# Altium schematic sheet 16_TEC.SchDoc
size 420 x 297 mm; SheetNumber: 25; SheetTotal: 33
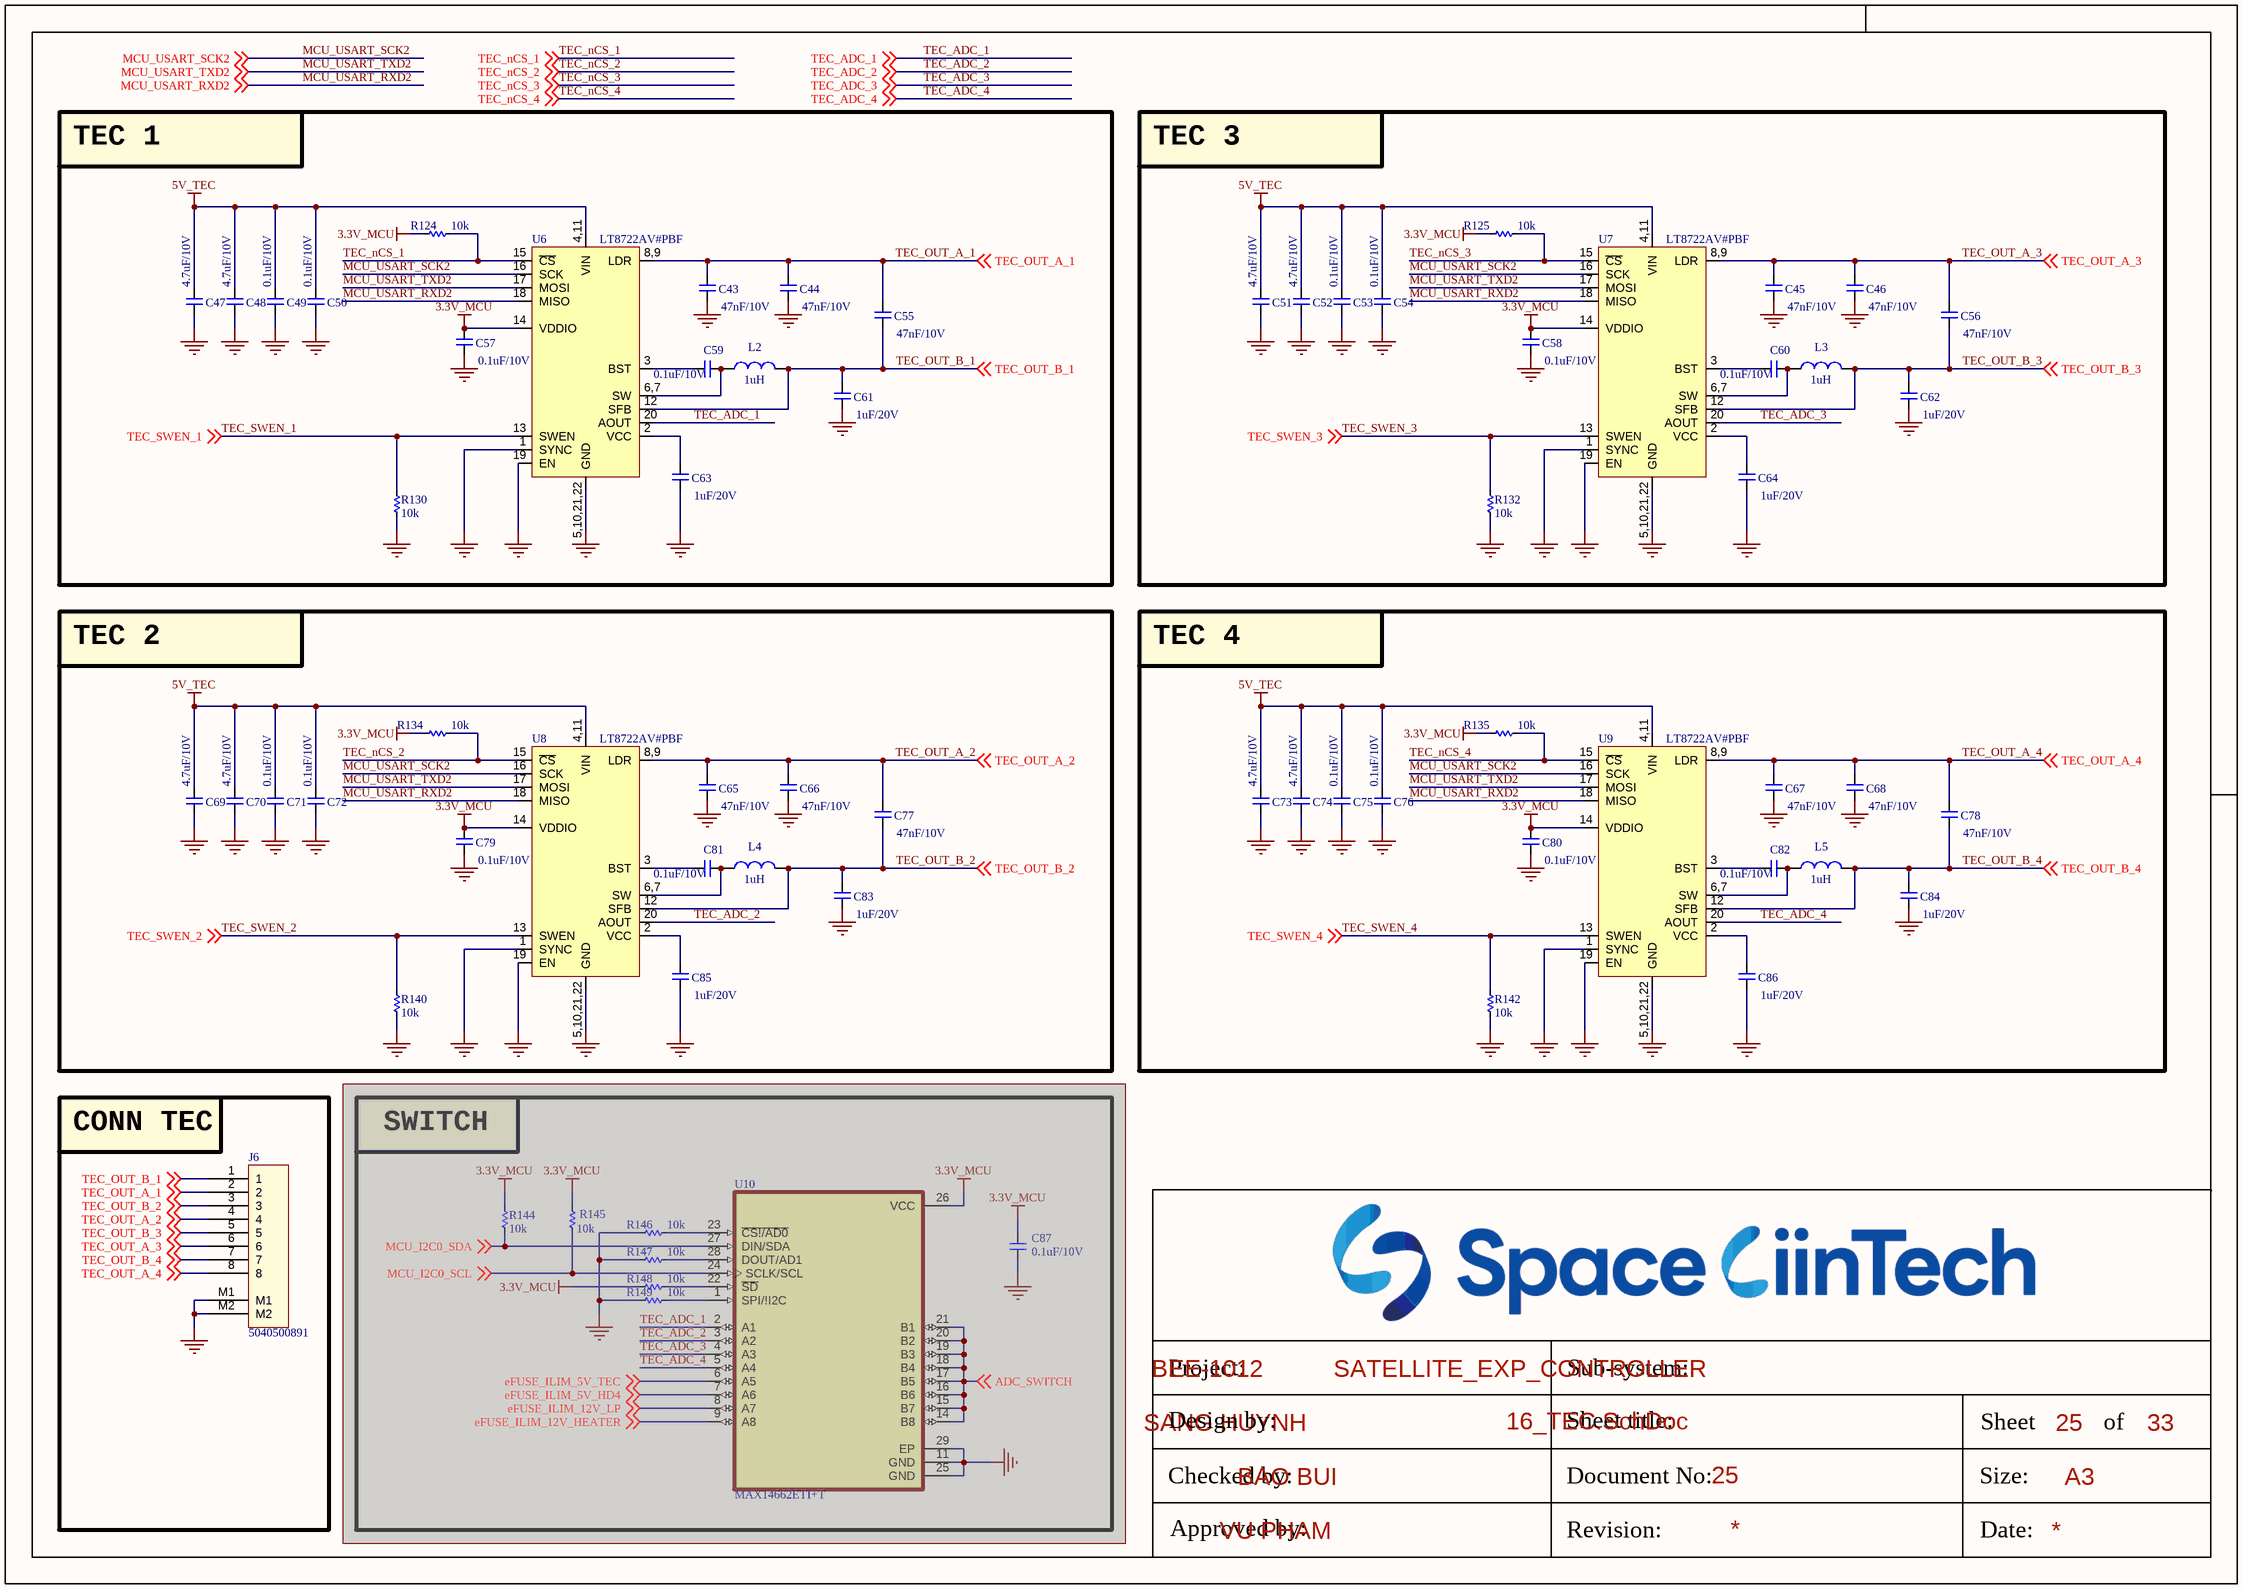
[diagram p0: 16_TEC.SchDoc]

## Parts
C43  47nF/10V  [CAP_C_1005X50_L]
C44  47nF/10V  [CAP_C_1005X50_L]
C45  47nF/10V  [CAP_C_1005X50_L]
C46  47nF/10V  [CAP_C_1005X50_L]
C47  4.7uF/10V  [CAP_C_1005X50_L]
C48  4.7uF/10V  [CAP_C_1005X50_L]
C49  0.1uF/10V  [CAP_C_1005X50_L]
C50  0.1uF/10V  [CAP_C_1005X50_L]
C51  4.7uF/10V  [CAP_C_1005X50_L]
C52  4.7uF/10V  [CAP_C_1005X50_L]
C53  0.1uF/10V  [CAP_C_1005X50_L]
C54  0.1uF/10V  [CAP_C_1005X50_L]
C55  47nF/10V  [CAP_C_1005X50_L]
C56  47nF/10V  [CAP_C_1005X50_L]
C57  0.1uF/10V  [CAP_C_1005X50_L]
C58  0.1uF/10V  [CAP_C_1005X50_L]
C59  0.1uF/10V  [CAP_C_1005X50_L]
C60  0.1uF/10V  [CAP_C_1005X50_L]
C61  1uF/20V  [CAP_C_1005X50_L]
C62  1uF/20V  [CAP_C_1005X50_L]
C63  1uF/20V  [CAP_C_1005X50_L]
C64  1uF/20V  [CAP_C_1005X50_L]
C65  47nF/10V  [CAP_C_1005X50_L]
C66  47nF/10V  [CAP_C_1005X50_L]
C67  47nF/10V  [CAP_C_1005X50_L]
C68  47nF/10V  [CAP_C_1005X50_L]
C69  4.7uF/10V  [CAP_C_1005X50_L]
C70  4.7uF/10V  [CAP_C_1005X50_L]
C71  0.1uF/10V  [CAP_C_1005X50_L]
C72  0.1uF/10V  [CAP_C_1005X50_L]
C73  4.7uF/10V  [CAP_C_1005X50_L]
C74  4.7uF/10V  [CAP_C_1005X50_L]
C75  0.1uF/10V  [CAP_C_1005X50_L]
C76  0.1uF/10V  [CAP_C_1005X50_L]
C77  47nF/10V  [CAP_C_1005X50_L]
C78  47nF/10V  [CAP_C_1005X50_L]
C79  0.1uF/10V  [CAP_C_1005X50_L]
C80  0.1uF/10V  [CAP_C_1005X50_L]
C81  0.1uF/10V  [CAP_C_1005X50_L]
C82  0.1uF/10V  [CAP_C_1005X50_L]
C83  1uF/20V  [CAP_C_1005X50_L]
C84  1uF/20V  [CAP_C_1005X50_L]
C85  1uF/20V  [CAP_C_1005X50_L]
C86  1uF/20V  [CAP_C_1005X50_L]
C87  0.1uF/10V  [CAP_C_1005X50_L]  (masked out: inside a compile mask, not in the netlist)
J6  5040500891  [MOLEX_5040500891]
L2  1uH  [L-SMD-M-3.5x3.5x2mm]
L3  1uH  [L-SMD-M-3.5x3.5x2mm]
L4  1uH  [L-SMD-M-3.5x3.5x2mm]
L5  1uH  [L-SMD-M-3.5x3.5x2mm]
R124  10k  [RES_C_1005x30_L]
R125  10k  [RES_C_1005x30_L]
R130  10k  [RES_C_1005x30_L]
R132  10k  [RES_C_1005x30_L]
R134  10k  [RES_C_1005x30_L]
R135  10k  [RES_C_1005x30_L]
R140  10k  [RES_C_1005x30_L]
R142  10k  [RES_C_1005x30_L]
R144  10k  [RES_C_1005x30_L]  (masked out: inside a compile mask, not in the netlist)
R145  10k  [RES_C_1005x30_L]  (masked out: inside a compile mask, not in the netlist)
R146  10k  [RES_C_1005x30_L]  (masked out: inside a compile mask, not in the netlist)
R147  10k  [RES_C_1005x30_L]  (masked out: inside a compile mask, not in the netlist)
R148  10k  [RES_C_1005x30_L]  (masked out: inside a compile mask, not in the netlist)
R149  10k  [RES_C_1005x30_L]  (masked out: inside a compile mask, not in the netlist)
U6  LT8722AV#PBF  [QFN18]
U7  LT8722AV#PBF  [QFN18]
U8  LT8722AV#PBF  [QFN18]
U9  LT8722AV#PBF  [QFN18]
U10  MAX14662ETI+T  [QFN40P400X400X80-29N]  (masked out: inside a compile mask, not in the netlist)

## Blocks framed on the sheet
TEC 1: C43 C44 C47-C50 C55 C57 C59 C61 C63 L2 R124 R130 U6
TEC 3: C45 C46 C51-C54 C56 C58 C60 C62 C64 L3 R125 R132 U7
TEC 2: C65 C66 C69-C72 C77 C79 C81 C83 C85 L4 R134 R140 U8
TEC 4: C67 C68 C73-C76 C78 C80 C82 C84 C86 L5 R135 R142 U9
CONN TEC: J6
SWITCH: C87 R144-R149 U10

## Nets
3.3V_MCU: C57.2 C58.2 C79.2 C80.2 R124.1 R125.1 R134.1 R135.1 U6.14(VDDIO) U7.14(VDDIO) U8.14(VDDIO) U9.14(VDDIO)
5V_TEC: C47.2 C48.2 C49.2 C50.2 C51.2 C52.2 C53.2 C54.2 C69.2 C70.2 C71.2 C72.2 C73.2 C74.2 C75.2 C76.2 U6.4,11(VIN) U7.4,11(VIN) U8.4,11(VIN) U9.4,11(VIN)
GND: C43.1 C44.1 C45.1 C46.1 C47.1 C48.1 C49.1 C50.1 C51.1 C52.1 C53.1 C54.1 C57.1 C58.1 C61.1 C62.1 C63.1 C64.1 C65.1 C66.1 C67.1 C68.1 C69.1 C70.1 C71.1 C72.1 C73.1 C74.1 C75.1 C76.1 C79.1 C80.1 C83.1 C84.1 C85.1 C86.1 J6.M1 J6.M2 R130.2 R132.2 R140.2 R142.2 U6.1(SYNC) U6.5,10,21,22(GND) U6.19(EN) U7.1(SYNC) U7.5,10,21,22(GND) U7.19(EN) U8.1(SYNC) U8.5,10,21,22(GND) U8.19(EN) U9.1(SYNC) U9.5,10,21,22(GND) U9.19(EN)
MCU_USART_RXD2: U6.18(MISO) U7.18(MISO) U8.18(MISO) U9.18(MISO) ; off-sheet MCU_USART_RXD2
MCU_USART_SCK2: U6.16(SCK) U7.16(SCK) U8.16(SCK) U9.16(SCK) ; off-sheet MCU_USART_SCK2
MCU_USART_TXD2: U6.17(MOSI) U7.17(MOSI) U8.17(MOSI) U9.17(MOSI) ; off-sheet MCU_USART_TXD2
TEC_ADC_1: U6.20(AOUT) ; off-sheet TEC_ADC_1
TEC_ADC_2: U8.20(AOUT) ; off-sheet TEC_ADC_2
TEC_ADC_3: U7.20(AOUT) ; off-sheet TEC_ADC_3
TEC_ADC_4: U9.20(AOUT) ; off-sheet TEC_ADC_4
TEC_nCS_1: R124.2 U6.15(~{CS}) ; off-sheet TEC_nCS_1
TEC_nCS_2: R134.2 U8.15(~{CS}) ; off-sheet TEC_nCS_2
TEC_nCS_3: R125.2 U7.15(~{CS}) ; off-sheet TEC_nCS_3
TEC_nCS_4: R135.2 U9.15(~{CS}) ; off-sheet TEC_nCS_4
TEC_OUT_A_1: C43.2 C44.2 C55.2 J6.2 U6.8,9(LDR) ; off-sheet TEC_OUT_A_1
TEC_OUT_A_2: C65.2 C66.2 C77.2 J6.4 U8.8,9(LDR) ; off-sheet TEC_OUT_A_2
TEC_OUT_A_3: C45.2 C46.2 C56.2 J6.6 U7.8,9(LDR) ; off-sheet TEC_OUT_A_3
TEC_OUT_A_4: C67.2 C68.2 C78.2 J6.8 U9.8,9(LDR) ; off-sheet TEC_OUT_A_4
TEC_OUT_B_1: C55.1 C61.2 J6.1 L2.2 U6.12(SFB) ; off-sheet TEC_OUT_B_1
TEC_OUT_B_2: C77.1 C83.2 J6.3 L4.2 U8.12(SFB) ; off-sheet TEC_OUT_B_2
TEC_OUT_B_3: C56.1 C62.2 J6.5 L3.2 U7.12(SFB) ; off-sheet TEC_OUT_B_3
TEC_OUT_B_4: C78.1 C84.2 J6.7 L5.2 U9.12(SFB) ; off-sheet TEC_OUT_B_4
TEC_SWEN_1: R130.1 U6.13(SWEN) ; off-sheet TEC_SWEN_1
TEC_SWEN_2: R140.1 U8.13(SWEN) ; off-sheet TEC_SWEN_2
TEC_SWEN_3: R132.1 U7.13(SWEN) ; off-sheet TEC_SWEN_3
TEC_SWEN_4: R142.1 U9.13(SWEN) ; off-sheet TEC_SWEN_4
NetC59_1: C59.1 L2.1 U6.6,7(SW)
NetC59_2: C59.2 U6.3(BST)
NetC60_1: C60.1 L3.1 U7.6,7(SW)
NetC60_2: C60.2 U7.3(BST)
NetC63_2: C63.2 U6.2(VCC)
NetC64_2: C64.2 U7.2(VCC)
NetC81_1: C81.1 L4.1 U8.6,7(SW)
NetC81_2: C81.2 U8.3(BST)
NetC82_1: C82.1 L5.1 U9.6,7(SW)
NetC82_2: C82.2 U9.3(BST)
NetC85_2: C85.2 U8.2(VCC)
NetC86_2: C86.2 U9.2(VCC)

## Notes on the sheet
- Project:
- BEE-1012
- Sub-system:
- SATELLITE_EXP_CONTROLLER
- Design by:
- SANG HUYNH
- BAO BUI
- Sheet title:
- Sheet
- A3
- of
- Checked by:
- Approved by:
- VU PHAM
- Revision:
- Document No:
- Size:
- Date:

## Library data of the parts
C43-C87 = _CAP_C_2: CAP
J6 = Header 8x1_2M
L2-L5 = L-SMD-1: partNo: 78477010; Manufacturer: Wurth Elektronik; Inductance: 1.0 μH; ComponentLink1Description: Manufacturer; ComponentLink1URL: http://www.we-online.de; Created by: Baojun Chen; Created Date: Nov.2015; ComponentLink2Description: Datasheet; ComponentLink2URL: http://katalog.we-online.de/pbs/datasheet/78477010.pdf
R124 R125 R130 R132 R134 R135 R140 R142 R144-R149 = _RES_B_2: RES
U6-U9 = LT8722
U10 = IC_SW_MAX14662ETI+T: 8 Circuit IC Switch 1:1 1Ohm 28-TQFN _4x4_; MF: Maxim Integrated; Package: TQFN-28 Maxim; Value: *; Price: None; MP: MAX14662ETI+T; SnapEDA_Link: https://www.snapeda.com/parts/MAX14662ETI%2BT/Maxim%20Integrated/view-part/546683/?ref=snap; Availability: Unavailable